# Altium schematic sheet Smartfin Main PCBA Temp Sensor Connection.SchDoc
size Letter; TOCFontName: Consolas; TOCFontSize: 24; TOCFontColor: 0; TOCFontAttributes: 0; TOCMaxLinesInTable: 25; TOCVerticalOffset: 200; TOCHorizontalOffset: 500; TOCHorizontalSeparation: 800; TOCVerticalSeparation: 30; TOCHorizTableSize: 640; PageSetup: Record=PageOptions|CenterHorizontal=True|CenterVertical=True|PrintScale=0.96|XCorrection=1.00|YCorrection=1.00|PrintKind=0|BorderSize=5000000|LeftOffset=0|BottomOffset=0|Orientation=2|PaperLength=1000|PaperWidth=1000|Scale=100|PaperSource=7|PrintQuality=-4|MediaType=1|DitherType=10|PaperKind=11" x 17"|PrintScaleMode=1; SheetNumber: 5; SheetTotal: 8
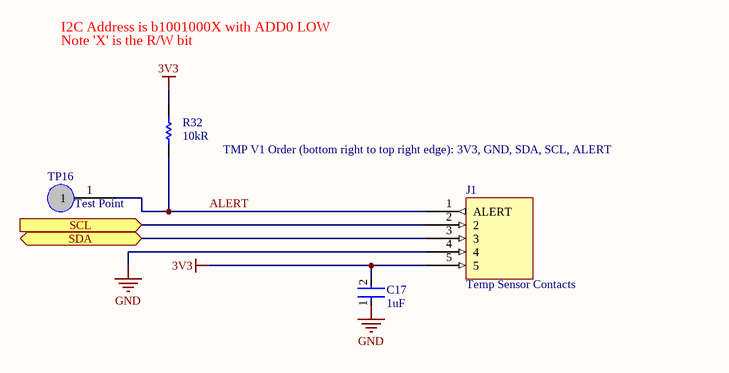
[diagram p0: Smartfin Main PCBA Temp Sensor Connection.SchDoc]

## Parts
C17  value 1uF  [FP-CC0402-IPC_C]  (hidden comment: cc0402krx5r6bb105)
J1  Temp Sensor Contacts  [Temp Sensor-Footprint-1]
R32  value 10kR  [RESC1005X04N]  (hidden comment: RC0402FR-0710KL)
TP16  Test Point  [New footprint 1]

## Ports
SCL (in), SDA (bidir)

## Nets
3V3: C17.2 J1.5 R32.2
GND: C17.1 J1.4
ALERT: J1.1(ALERT) R32.1 TP16.1
SCL: J1.2 ; port SCL
SDA: J1.3 ; port SDA

## Notes on the sheet
- I2C Address is b1001000X with ADD0 LOW
- Note 'X' is the R/W bit
- TMP V1 Order (bottom right to top right edge): 3V3, GND, SDA, SCL, ALERT

## Library data of the parts
C17 = YAGEO-CC0402KRX5R6BB105-1: Ceramic Capacitor, Multilayer, Ceramic, 10V, 10% +Tol, 10% -Tol, X5R, 15% TC, 1uF, Surface Mount, 0402
J1 = CMP-002-000044-2: Smartfin Temperature Sensor Port
R32 = CMP-002-000053-2: Fixed Resistor, Metal Glaze/thick Film, 0.0625W, 10000ohm, 50V, 1% +/-Tol, 100ppm/Cel, Surface Mount, 0402
TP16 = CMP-00002-11